# EAGLE design Battery_Monitoring_with_kill (EAGLE 8.4.3)
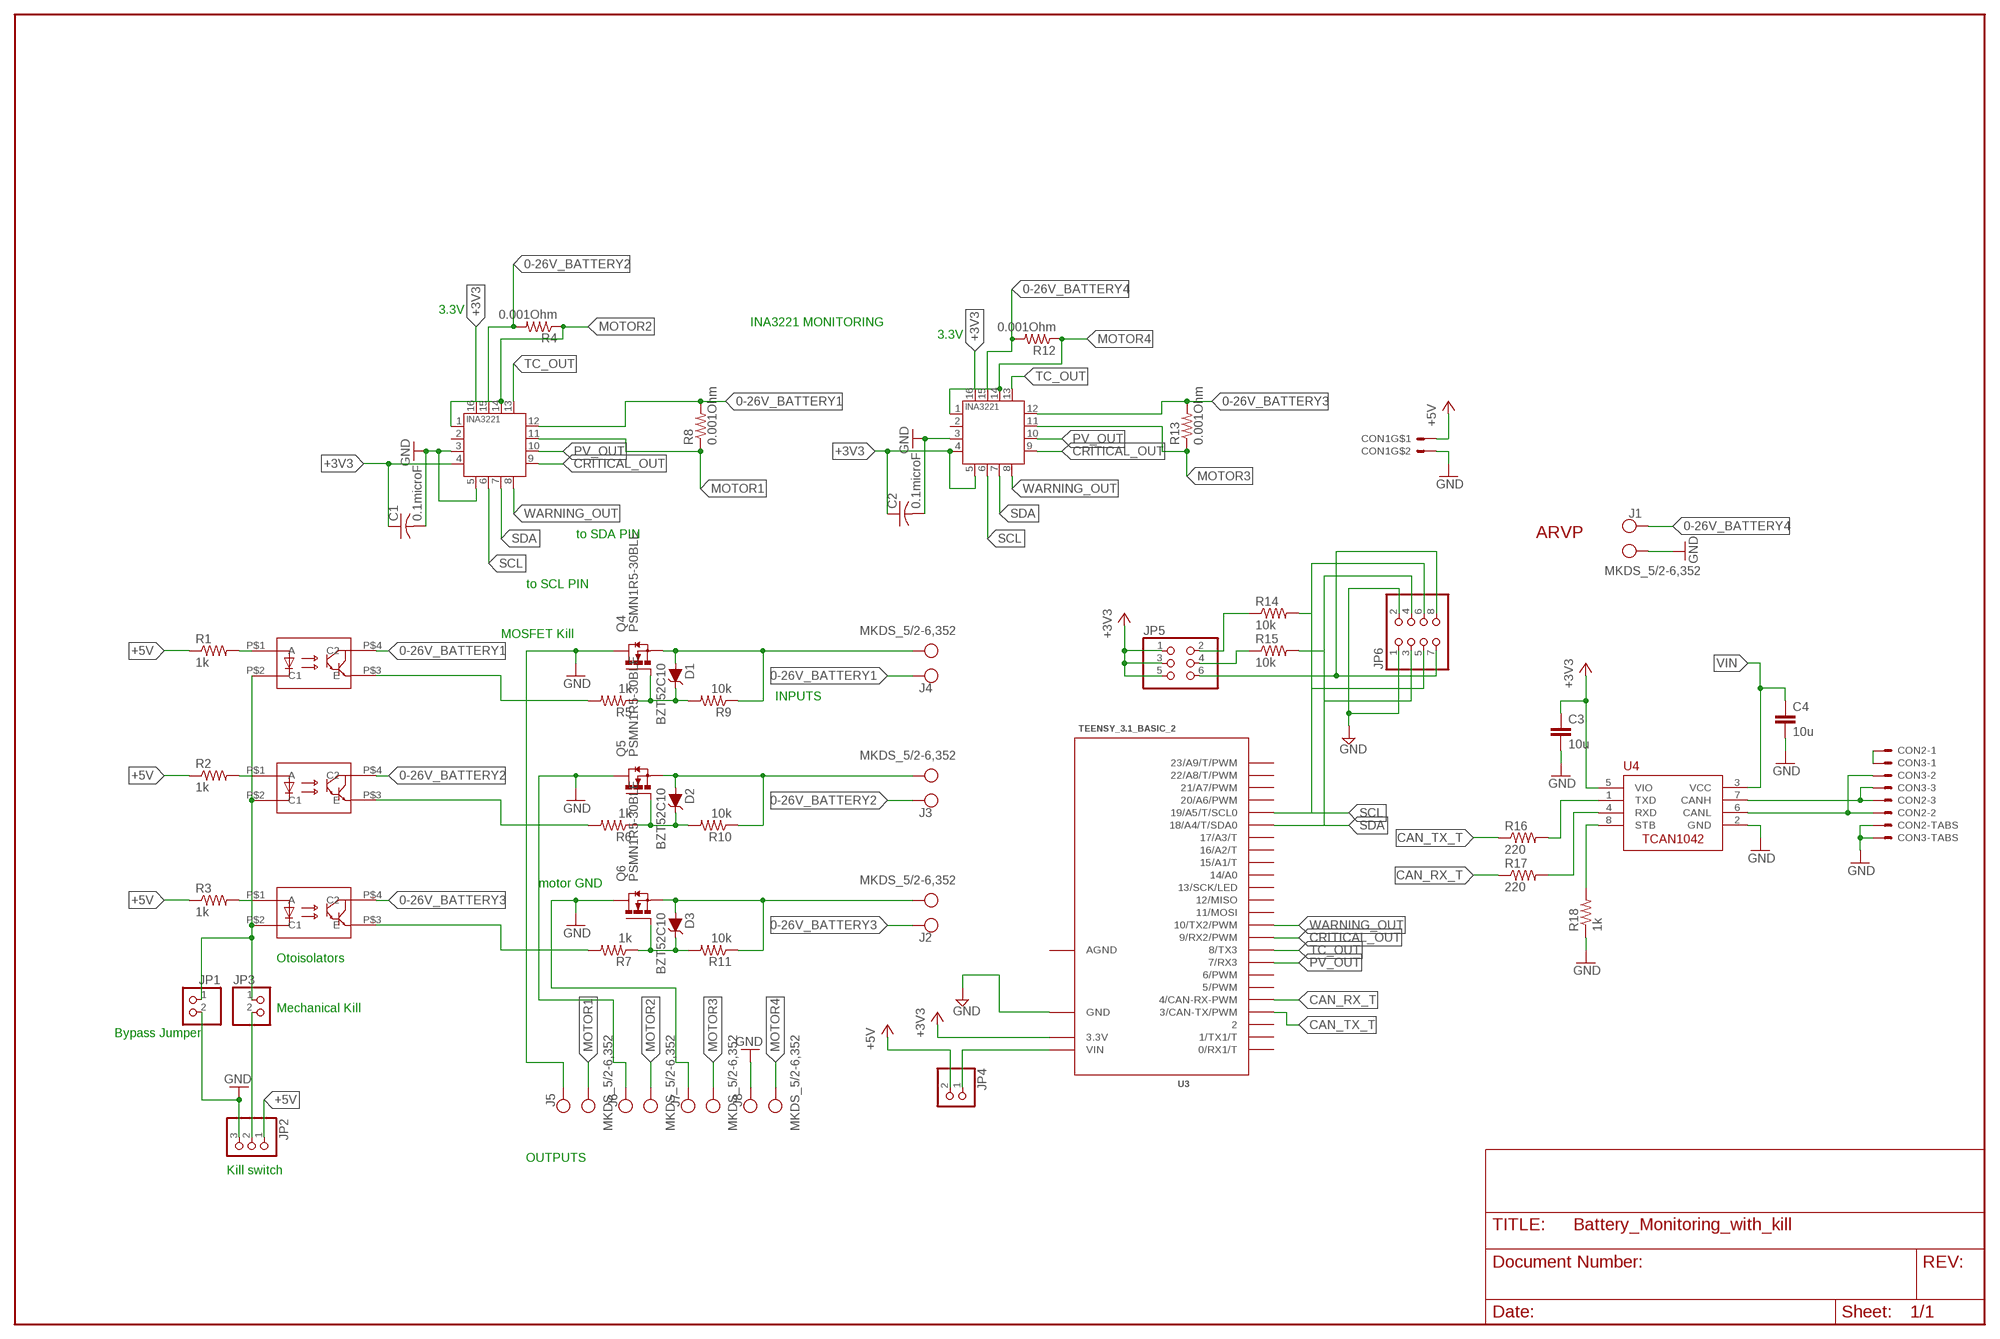
[diagram p0: schematic, sheet 1]

## Parts
ARVP1  ARVP_LOGO  [ARVP]
C1  0.1microF  C-USC2012  [C2012]
C2  0.1microF  C-USC2012  [C2012]
C3  10u  C-EUC0805  [C0805]
C4  10u  C-EUC0805  [C0805]
CON1  MOLEX_5566-2  [5566-2]
CON2  SM03B-GHS-TB  [SM03B-GHS-TB]
CON3  SM03B-GHS-TB  [SM03B-GHS-TB]
D1  BZT52C10  [SOD-123]
D2  BZT52C10  [SOD-123]
D3  BZT52C10  [SOD-123]
J1  MKDS_5/2-6,352  [MKDS_5/2-6,35]
J2  MKDS_5/2-6,352  [MKDS_5/2-6,35]
J3  MKDS_5/2-6,352  [MKDS_5/2-6,35]
J4  MKDS_5/2-6,352  [MKDS_5/2-6,35]
J5  MKDS_5/2-6,352  [MKDS_5/2-6,35]
J6  MKDS_5/2-6,352  [MKDS_5/2-6,35]
J7  MKDS_5/2-6,352  [MKDS_5/2-6,35]
J8  MKDS_5/2-6,352  [MKDS_5/2-6,35]
JP1  PINHD-1X2  [1X02]
JP2  PINHD-1X3  [1X03]
JP3  PINHD-1X2  [1X02]
JP4  PINHD-1X2  [1X02]
JP5  PINHD-2X3  [2X03]
JP6  PINHD-2X4  [2X04]
Q1  TCLD1000CT  [SOP-4L]
Q2  TCLD1000CT  [SOP-4L]
Q3  TCLD1000CT  [SOP-4L]
Q4  PSMN1R5-30BLE  [SOT404/D2PAK]
Q5  PSMN1R5-30BLE  [SOT404/D2PAK]
Q6  PSMN1R5-30BLE  [SOT404/D2PAK]
R1  1k  R-US_R0805  [R0805]
R2  1k  R-US_R0805  [R0805]
R3  1k  R-US_R0805  [R0805]
R4  0.001Ohm  HCS3920FT1L00  [3920]
R5  1k  R-US_M1206  [M1206]
R6  1k  R-US_M1206  [M1206]
R7  1k  R-US_M1206  [M1206]
R8  0.001Ohm  HCS3920FT1L00  [3920]
R9  10k  R-US_M1206  [M1206]
R10  10k  R-US_M1206  [M1206]
R11  10k  R-US_M1206  [M1206]
R12  0.001Ohm  HCS3920FT1L00  [3920]
R13  0.001Ohm  HCS3920FT1L00  [3920]
R14  10k  R-US_R1206  [R1206]
R15  10k  R-US_R1206  [R1206]
R16  220  R-US_R0805  [R0805]
R17  220  R-US_R0805  [R0805]
R18  1k  R-US_R0805  [R0805]
U1  INA3221.  [HVQFN16_4X4]
U2  INA3221.  [HVQFN16_4X4]
U3  TEENSY_3.1_BASIC_2  [TEENSY_3.1_BASIC_2]
U4  TCAN1042HVDR  [SO-8]

## Nets
0-26V_BATTERY1: J4.2(KL1) Q1.P$4(C2) R8.P$2 U1.12(IN+1)
0-26V_BATTERY2: J3.2(KL1) Q2.P$4(C2) R4.P$2 U1.15(IN+2)
0-26V_BATTERY3: J2.2(KL1) Q3.P$4(C2) R13.P$2 U2.12(IN+1)
0-26V_BATTERY4: J1.2(KL1) R12.P$2 U2.15(IN+2)
+3V3: C1.1 C2.1 C3.1 JP5.1 JP5.3 JP5.5 U1.4(VS) U1.16(VPU) U2.4(VS) U2.5(A0) U2.16(VPU) U3.3.3V U4.5(VIO)
+5V: CON1.1 JP2.1 JP4.2 R1.1 R2.1 R3.1
BATT1GND: D1.P$2(A) J4.1(KL) Q4.3S(S) R9.1
BATT2GND: D2.P$2(A) J3.1(KL) Q5.3S(S) R10.1
BATT3GND: D3.P$2(A) J2.1(KL) Q6.3S(S) R11.1
CAN_RX1: R17.2 U4.4(RXD)
CAN_RX_T: R17.1 U3.4(4/CAN-RX-PWM)
CAN_TX2: R16.2 U4.1(TXD)
CAN_TX_T: R16.1 U3.3(3/CAN-TX/PWM)
CANH1: CON2.P$3 CON3.P$3 U4.7(CANH)
CANL1: CON2.P$2 CON3.P$2 U4.6(CANL)
CANSH1: CON2.P$1 CON3.P$1
CRITICAL_OUT: U1.9(CRITICAL) U2.9(CRITICAL) U3.9(9/RX2/PWM)
E1: Q1.P$3(E) R5.2
E2: Q2.P$3(E) R6.2
E3: Q3.P$3(E) R7.2
GND: C1.2 C2.2 C3.2 C4.2 CON1.2 CON2.P$4 CON2.P$5 CON3.P$4 CON3.P$5 J1.1(KL) J5.2(KL1) J6.2(KL1) J7.2(KL1) J8.2(KL1) JP1.2 JP2.3 JP6.1 JP6.2 Q4.2D(D) Q5.2D(D) Q6.2D(D) R18.1 U1.3(GND) U1.5(A0) U2.3(GND) U3.GND U4.2(GND)
I2C_3V1: JP5.6 JP6.7 JP6.8
MG1: D1.P$1(C) Q4.1G(G) R5.1 R9.2
MG2: D2.P$1(C) Q5.1G(G) R6.1 R10.2
MG3: D3.P$1(C) Q6.1G(G) R7.1 R11.2
MOTOR1: J5.1(KL) R8.P$1 U1.11(IN-1)
MOTOR2: J6.1(KL) R4.P$1 U1.1(IN-3) U1.14(IN-2)
MOTOR3: J7.1(KL) R13.P$1 U2.11(IN-1)
MOTOR4: J8.1(KL) R12.P$1 U2.1(IN-3) U2.14(IN-2)
N$1: Q1.P$1(A) R1.2
N$2: Q2.P$1(A) R2.2
N$3: Q3.P$1(A) R3.2
N$4: JP1.1 JP3.1 Q1.P$2(C1) Q2.P$2(C1) Q3.P$2(C1)
N$5: JP2.2 JP3.2
PV_OUT: U1.10(PV) U2.10(PV) U3.7(7/RX3)
SCL: JP6.5 JP6.6 R14.2 U1.6(SCL) U2.6(SCL) U3.19/A5(19/A5/T/SCL0)
SCL_3V1: JP5.2 R14.1
SDA: JP6.3 JP6.4 R15.2 U1.7(SDA) U2.7(SDA) U3.18/A4(18/A4/T/SDA0)
SDA_3V1: JP5.4 R15.1
STB1: R18.2 U4.8(STB)
TC_OUT: U1.13(TC) U2.13(TC) U3.8(8/TX3)
VIN: C4.1 JP4.1 U3.VIN U4.3(VCC)
WARNING_OUT: U1.8(WARNING) U2.8(WARNING) U3.10(10/TX2/PWM)
Unconnected: U1.2(IN+3) U2.2(IN+3) U3.0(0/RX1/T) U3.1(1/TX1/T) U3.2 U3.5(5/PWM) U3.6(6/PWM) U3.11(11/MOSI) U3.12(12/MISO) U3.13(13/SCK/LED) U3.14/A0 U3.15/A1(15/A1/T) U3.16/A2(16/A2/T) U3.17/A3(17/A3/T) U3.20/A6(20/A6/PWM) U3.21/A7(21/A7/PWM) U3.22/A8(22/A8/T/PWM) U3.23/A9(23/A9/T/PWM)

## Notes on the sheet
- 3.3V
- INA3221 MONITORING
- 3.3V
- to SDA PIN
- to SCL PIN
- MOSFET Kill
- INPUTS
- motor GND
- Otoisolators
- Mechanical Kill
- Bypass Jumper
- OUTPUTS
- Kill switch

## Power pins joined to a net without a drawn wire
AGND: U3.AGND

## Library data of the parts
ARVP1 = ARVP:ARVP_LOGO
C1 C2 = resistor:C-US: CAPACITOR, American symbol
C3 C4 = rcl:C-EU: CAPACITOR, European symbol
CON1 = ARVP:MOLEX_5566-2
CON2 CON3 = ARVP:SM03B-GHS-TB
D1-D3 = Moira:BZT52C10: DIODE ZENER 10V 500MW SOD123 by Diodes Incorporated Digikey: BZT52C10-FDICT-ND
J1-J8 = Moira:MKDS_5/2-6,35: CONN TERM BLOCK 2POS 6.35MM PCB, 2 Position Wire to Board Terminal Block Horizontal with Board 0.250" (6.35mm) Through Hole, Phoenix Contact (1714955), Digikey:277-1269-ND, MKDS 5/2-6,35 package adpated from Eagle library package MKDS 5/3-6,35
JP1 JP3 JP4 = pinhead:PINHD-1X2: PIN HEADER
JP2 = pinhead:PINHD-1X3: PIN HEADER
JP5 = pinhead:PINHD-2X3: PIN HEADER
JP6 = pinhead:PINHD-2X4: PIN HEADER
Q1 = Moira:TCLD1000CT: OPTOISOLTR 5KV DARLINGTON 4-SOP by VISHAY Digikey: TCLD1000CT_ND; SPICEPREFIX: E
Q2 Q3 = Moira:TCLD1000CT: OPTOISOLTR 5KV DARLINGTON 4-SOP by VISHAY Digikey: TCLD1000CT_ND
Q4-Q6 = Moira:PSMN1R5-30BLE: N-channel 30 V 1.5 mΩ logic level MOSFET in D2PAK by Nexperia USA Inc. Digikey: 1727-1101-1-ND
R1-R3 R5-R7 R9-R11 = adafruit:R-US_: RESISTOR, American symbol
R4 R8 R12 R13 = Moira:HCS3920: 0.001 Ohm ±1% 5W Chip Resistor 4020 Automotive AEC-Q200, Current Sense, Moisture Resistant Metal Element Stackpole Electronics Inc. Digikey: HCS3920FT1L00CT-ND
R14-R18 = rcl:R-US_: RESISTOR, American symbol
U1 U2 = INA3221:INA3221: The INA3221 is a three-channel, high-side current and bus voltage monitor with an I 2C- and SMBUScompatible interface. The INA3221 monitors both shunt voltage drops and bus supply voltages, in addition to having programmable conversion times and averaging modes for these signals. The INA3221 offers both critical and warning alerts to detect multiple programmable out-of-range conditions for each channel.
U3 = Teensy_3_Series_Board_v1.0:TEENSY_3.1_BASIC_2: Footprint for Teensy 3.1 board using all pin connections on the outer perimeter
U4 = ARVP:TCAN1042HVDR

## Net classes
1 net1: clearance 0.203 mm to class 0

## Board
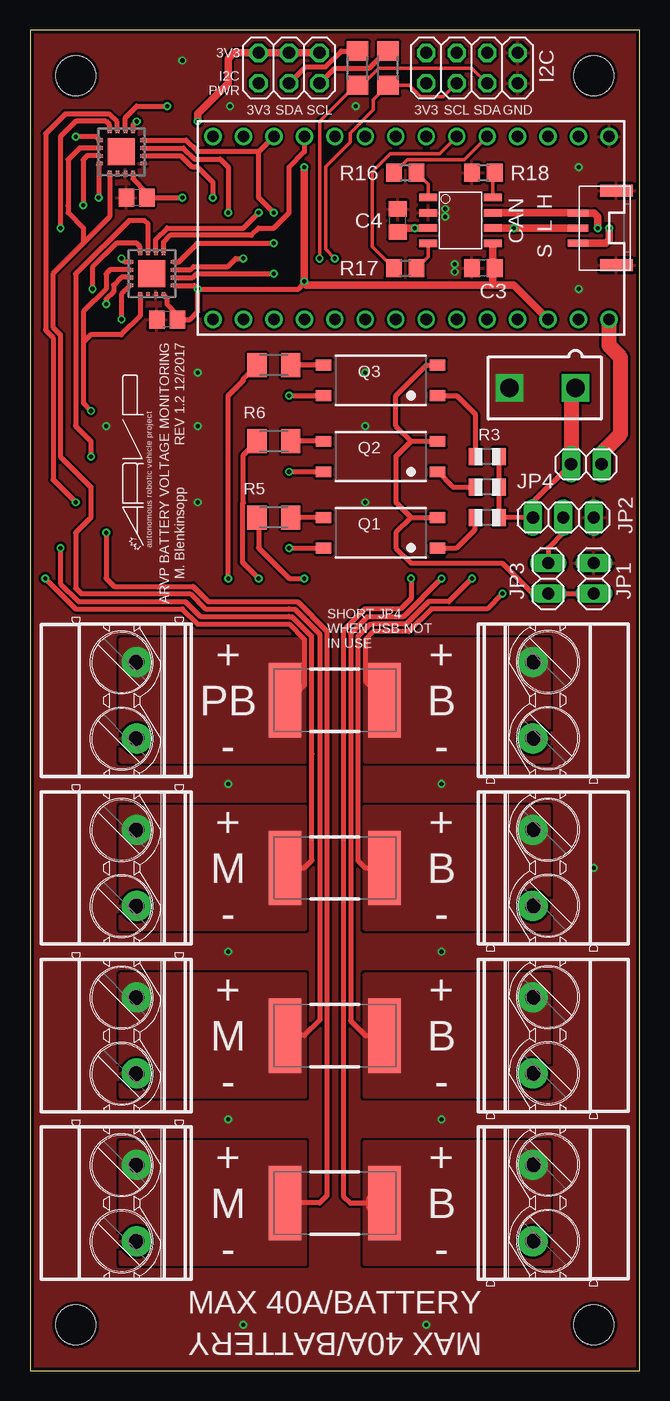
[diagram p1: board, top side]
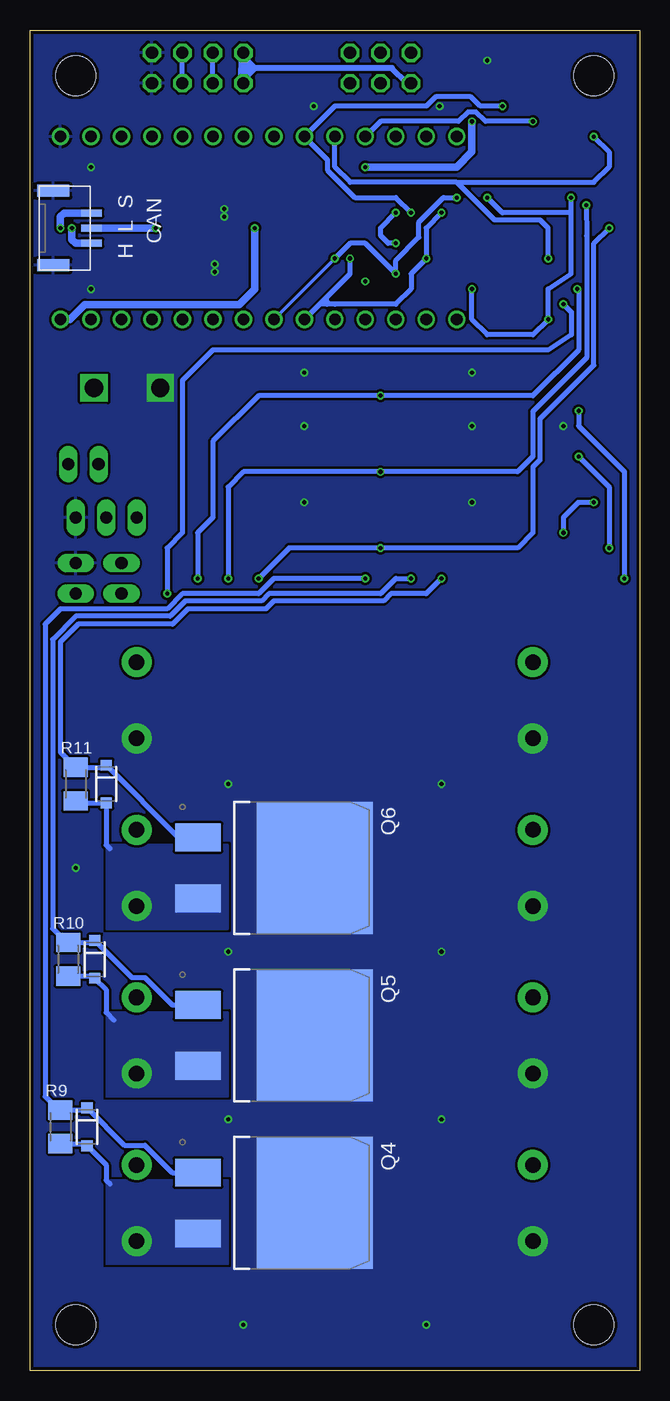
[diagram p2: board, bottom side, seen from below]

Size 50.8 x 111.76 mm. Coordinates in mm from the lower left corner, seen from the top.
Outline: 50.8,0 50.8,111.76 0,111.76 0,0 50.8,0
Copper layers (1*16): Top 0.035mm / dielectric 1.5mm / Bottom 0.035mm
Design rules "ITEADstudioDRC *": minimum track width 6mil, minimum drill 12mil, track to track 8mil, track to pad 8mil, pad to pad 8mil, via to via 8mil, smd to smd 0mil, copper to edge 10mil, drill to drill 10mil, minimum pad ring 6mil, minimum via ring 6mil, stop-mask expansion 2mil, vias tented up to drill 100mil, thermal gap 10mil
Milling: 4 lines

### Footprints (pad centres in the part's own frame; a part is rotated, then mirrored left to right if it is on the bottom)
C2012 = smd 1.3 x 1.5: 1 -0.85,0; 2 0.85,0
C0805 = smd 1.3 x 1.5: 1 -0.95,0; 2 0.95,0
5566-2 = drill 1.524 square: 1 0,-2.756; 2 0,2.756
SM03B-GHS-TB = smd 0.6 x 1.7: P$1 -1.25,0.85; P$2 0,0.85; P$3 1.25,0.85 | smd 1 x 2.7: P$4 -3.1,-2.35; P$5 3.1,-2.35
SOD-123 = smd 0.9 x 0.95: P$1 -1.575,0; P$2 1.575,0
MKDS_5/2-6,35 = drill 1.3 pad 2.5: 1 -3.175,0; 2 3.175,0
1X02 = drill 1.016 long: 1 -1.27,0; 2 1.27,0
1X03 = drill 1.016 long: 1 -2.54,0; 2 0,0; 3 2.54,0
2X03 = drill 1.016 octagon: 1 -2.54,-1.27; 2 -2.54,1.27; 3 0,-1.27; 4 0,1.27; 5 2.54,-1.27; 6 2.54,1.27
2X04 = drill 1.016 octagon: 1 -3.81,-1.27; 2 -3.81,1.27; 3 -1.27,-1.27; 4 -1.27,1.27; 5 1.27,-1.27; 6 1.27,1.27; 7 3.81,-1.27; 8 3.81,1.27
SOP-4L = smd 1.3 x 0.9: P$1 -4.75,1.27; P$2 -4.75,-1.27; P$3 4.75,-1.27; P$4 4.75,1.27
SOT404/D2PAK = smd 2.32 x 3.81: 1G -2.54,-6.32; 3S 2.54,-6.32 | smd 11 x 9.65: 2D 0,3.4
R0805 = smd 1.1 x 1.4: 1 -1,0; 2 1,0
3920 = smd 2.7 x 6.2: P$1 -4.15,0; P$2 4.15,0
M1206 = smd 1.6 x 2: 1 -1.4,0; 2 1.4,0
R1206 = smd 1.6 x 1.803: 1 -1.422,0; 2 1.422,0
R0805' = smd 1.3 x 1.5: 1 -0.95,0; 2 0.95,0
HVQFN16_4X4 = smd 0.5 x 0.3: 1 -1.8,0.975; 2 -1.8,0.325; 3 -1.8,-0.325; 4 -1.8,-0.975; 9 1.8,-0.975; 10 1.8,-0.325; 11 1.8,0.325; 12 1.8,0.975 | smd 0.3 x 0.5: 5 -0.975,-1.8; 6 -0.325,-1.8; 7 0.325,-1.8; 8 0.975,-1.8; 13 0.975,1.8; 14 0.325,1.8; 15 -0.325,1.8; 16 -0.975,1.8 | smd 2.25 x 2.25: TH 0,0
TEENSY_3.1_BASIC_2 = drill 0.965: 0 -7.62,13.97; 1 -7.62,11.43; 2 -7.62,8.89; 3 -7.62,6.35; 3.3V 7.62,11.43; 4 -7.62,3.81; 5 -7.62,1.27; 6 -7.62,-1.27; 7 -7.62,-3.81; 8 -7.62,-6.35; 9 -7.62,-8.89; 10 -7.62,-11.43; 11 -7.62,-13.97; 12 -7.62,-16.51; 13 7.62,-16.51; 14/A0 7.62,-13.97; 15/A1 7.62,-11.43; 16/A2 7.62,-8.89; 17/A3 7.62,-6.35; 18/A4 7.62,-3.81; 19/A5 7.62,-1.27; 20/A6 7.62,1.27; 21/A7 7.62,3.81; 22/A8 7.62,6.35; 23/A9 7.62,8.89; AGND 7.62,13.97; GND -7.62,16.51; VIN 7.62,16.51
SO-8 = smd 1.524 x 0.61: 1 -2.692,1.905; 2 -2.692,0.635; 3 -2.692,-0.635; 4 -2.692,-1.905; 5 2.692,-1.905; 6 2.692,-0.635; 7 2.692,0.635; 8 2.692,1.905
STAND-OFF = hole 3.302: 0,0

### Placement (x,y rotation side)
ARVP1  10.16,68.58 90 top
C1  8.89,97.79 180 top
C2  11.43,87.63 180 top
C3  37.78,91.92 180 top
C4  30.64,95.88 90 top
CON1  42.7,81.91 90 top
CON2  46.51,95.25 90 top
CON3  46.51,95.25 270 bottom
D1  46.04,20.32 270 bottom
D2  45.4,34.29 270 bottom
D3  44.45,48.89 270 bottom
J1  41.91,55.88 90 top
J2  41.91,41.91 90 top
J3  41.91,27.94 90 top
J4  41.91,13.97 90 top
J5  8.89,13.97 270 top
J6  8.89,27.94 270 top
J7  8.89,41.91 270 top
J8  8.89,55.88 270 top
JP1  46.99,66.04 90 top
JP2  44.45,71.12 0 top
JP3  43.18,66.04 90 top
JP4  46.36,75.56 180 top
JP5  21.59,108.59 180 top
JP6  36.83,108.59 180 top
Q1  29.21,69.85 180 top
Q2  29.21,76.2 180 top
Q3  29.21,82.55 180 top
Q4  30.48,13.97 270 bottom
Q5  30.48,27.94 270 bottom
Q6  30.48,41.91 270 bottom
R1  38.1,71.12 180 top
R2  38.1,73.66 180 top
R3  38.1,76.2 180 top
R4  25.4,27.94 0 top
R5  20.32,71.12 0 top
R6  20.32,77.47 0 top
R7  20.32,83.82 0 top
R8  25.4,13.97 0 top
R9  48.26,20.32 90 bottom
R10  47.62,34.29 90 bottom
R11  46.99,48.89 90 bottom
R12  25.4,55.88 0 top
R13  25.4,41.91 0 top
R14  29.84,108.59 270 top
R15  27.31,108.59 270 top
R16  220  [R0805']  31.27,99.85 0 top
R17  220  [R0805']  31.27,91.92 0 top
R18  1k  [R0805']  37.78,99.85 0 top
U1  7.62,101.6 90 top
U2  10.16,91.44 90 top
U3  31.75,95.25 270 top
U4  35.88,95.88 0 top
U$9  [LETTER_P]  -63.5,-71.12 0 top  (outside the outline)
U$15  [DOCFIELD]  20.32,-71.12 0 top  (outside the outline)
U$18  [STAND-OFF]  46.99,107.95 90 top
U$24  [STAND-OFF]  46.99,3.81 90 top
U$25  [STAND-OFF]  3.81,3.81 90 top
U$26  [STAND-OFF]  3.81,107.95 90 top

### Tracks (layer width: path | path; a pad name or v marks a point on that pad's centre or on a via)
0-26V_BATTERY1  (via drill 0.35)
  Top 0.406: U1.12 6.64,103.84 6.35,104.14 3.81,104.14 2.54,102.87 v2.54,95.25 | v21.59,68.58 Q1.P$4 | 29.21,13.97 26.67,13.97 26.11,14.53 26.11,61.72 27.84,63.45 27.89,63.45 27.94,63.5 30.89,63.5 31.75,64.36 v31.75,66.04
  Top 2.54: 29.21,13.97 R8.P$2
  Bottom 0.406: v2.54,95.25 3.81,93.98 3.81,83.82 8.28,79.35 8.28,75.95 8.89,75.34 8.89,69.85 10.16,68.58 v21.59,68.58 29.21,68.58 v31.75,66.04
  pour Top (no thermals): 27.94,8.89 27.94,19.05 43.18,19.05 43.18,8.89
0-26V_BATTERY2  (via drill 0.35)
  Top 0.406: U1.15 4.75,101.28 4.42,100.94 4.42,97.18 v4.44,97.16 | v21.59,74.93 Q2.P$4 | R4.P$2 27.94,27.94 26.72,29.16 26.72,61.47 28.09,62.84 31.09,62.84 v34.29,66.04
  Bottom 0.406: v4.44,97.16 4.42,94.59 4.42,84.43 8.89,79.96 8.89,76.2 10.16,74.93 v21.59,74.93 33.02,74.93 34.29,73.66 v34.29,66.04
  pour Top (no thermals): 27.94,22.86 27.94,33.02 43.18,33.02 43.18,22.86
0-26V_BATTERY3  (via drill 0.35)
  Top 0.406: U2.12 9.19,93.69 8.89,93.98 7.21,93.98 5.2,91.97 v5.2,90.17 | v21.59,81.28 Q3.P$4 | v36.83,66.04 34.9,64.11 33.22,64.11 31.34,62.23 28.58,62.23 28.55,62.2 28.32,62.2 27.33,61.21 27.33,42.52 27.94,41.91 R13.P$2
  Bottom 0.406: v5.2,90.17 5.08,90.05 5.08,85.09 8.89,81.28 v21.59,81.28 31.75,81.28 35.56,77.47 35.56,71.12 36.83,69.85 v36.83,66.04
  pour Top (no thermals): 27.94,36.83 27.94,46.99 43.18,46.99 43.18,36.83
0-26V_BATTERY4  (via drill 0.35)
  Top 0.406: U2.15 8.32,91.16 7.62,91.16 6.96,90.5 6.96,89.92 6.35,89.31 v6.35,88.9 | 30.48,56.81 R12.P$2 27.94,57.49 27.94,60.96 28.58,61.59 31.57,61.59 33.47,63.5 38.1,63.5 v39.37,64.77
  Bottom 0.406: v6.35,88.9 5.69,88.24 5.69,86.36 7.62,85.09 35.56,85.09 38.1,82.55 38.1,69.85 39.37,68.58 v39.37,64.77
  pour Top (no thermals): 27.94,50.8 27.94,60.96 43.18,60.96 43.18,50.8
+3V3  (via drill 0.35)
  Top 0.406: U2.4 11.43,89.34 11.43,88.9 12.28,88.05 C2.1 13.33,87.63 13.97,88.26 v13.97,90.17 | U1.4 8.59,99.35 9.74,98.21 C1.1 v12.7,97.79 | U1.16 5.72,100.52 v5.72,97.79 | U2.16 7.62,89.72 v7.62,87.63 | v13.97,90.17 13.67,90.47 U2.5 | v13.97,90.17 22.38,90.17 22.86,90.65
  Top 0.61: v13.97,104.14 13.97,104.78 16.51,107.31 16.51,109.38 16.99,109.85 JP5.5 JP5.3 JP5.1 | 38.57,92.08 U4.5 | 38.57,92.08 C3.1 38.58,91.76 38.58,90.49 | 38.57,91.92 38.57,92.08 | U3.3.3V 40.32,90.49 38.58,90.49 | 38.58,90.49 23.02,90.49 22.86,90.65 v22.86,90.81 v22.86,100.33
  Bottom 0.406: 5.72,96.52 v5.72,97.79 | 5.72,96.52 11.43,96.52 v12.7,97.79 | v13.97,90.17 13.97,87.63 12.7,86.36 8.89,86.36 v7.62,87.63 7.62,90.17 5.72,91.44 5.72,96.52
  Bottom 0.61: v13.97,104.14 13.97,101.6 15.24,100.33 v22.86,100.33
+5V
  Top 0.406: JP4.2 41.91,72.39 JP2.1 R1.1 R2.1 R3.1
  Top 1.27: JP4.2 45.08,81.54 CON1.1
BATT1GND
  Bottom 0.406: R9.1 46.21,18.92 D1.P$2 44.45,17.16 44.45,15.88 44.13,15.56
  pour Bottom (no thermals): 44.45,15.88 44.45,8.89 34.29,8.89 34.29,15.88
BATT2GND
  Bottom 0.406: R10.1 45.58,32.89 D2.P$2 44.45,31.76 44.45,29.84 43.81,29.21
  pour Bottom (no thermals): 44.45,29.84 44.45,22.86 34.29,22.86 34.29,29.84
BATT3GND
  Bottom 0.406: R11.1 46.81,47.32 D3.P$2 44.45,43.81 44.13,43.5
  pour Bottom (no thermals): 44.45,43.81 44.45,36.83 34.29,36.83 34.29,43.81
CAN_RX1
  Top 0.305: U4.4 33.19,92.88 R17.2
CAN_RX_T
  Top 0.305: U3.4 34.16,101.47 30.03,101.47 28.53,99.96 28.53,93.71 R17.1
CAN_TX2
  Top 0.305: U4.1 33.19,98.89 R16.2
CAN_TX_T
  Top 0.305: U3.3 36.19,100.96 31.43,100.96 31.22,100.75 R16.1
CANH1  (via drill 0.35)
  Top 0.61: U4.7 45.64,96.52 CON2.P$3 47.01,96.5 47.31,96.2 v47.31,95.25
  Bottom 0.61: v47.31,95.25 47.31,94.3 46.99,93.98 45.68,93.98 CON3.P$3
CANL1  (via drill 0.35)
  Top 0.61: U4.6 v40.32,95.25 CON3.P$2
  Bottom 0.61: v40.32,95.25 CON3.P$2
CANSH1  (via drill 0.35)
  Top 0.61: CON2.P$1 47.96,94 48.26,94.3 v48.26,95.25
  Bottom 0.61: v48.26,95.25 48.26,96.2 47.96,96.5 CON3.P$1
CRITICAL_OUT  (via drill 0.35)
  Top 0.406: U1.9 8.59,103.84 v8.89,104.14 | U2.9 11.14,94.09 11.68,94.64 18.44,94.64 19.05,95.25 20.32,95.25 21.59,96.52 21.59,100.33 22.86,101.6 U3.9
  Bottom 0.406: v8.89,104.14 12.86,104.14 13.64,104.92 14.3,104.92 15.08,104.14 21.59,104.14 U3.9
E1
  Top 0.406: Q1.P$3 R5.2
E2
  Top 0.406: Q2.P$3 R6.2
E3
  Top 0.406: Q3.P$3 R7.2
GND  (via drill 0.35)
  Top 0.406: 10.48,87.72 C2.2 | 7.94,97.88 C1.2
  other vias: 35.4,92.23 35.4,91.6 34.61,96.84 34.61,96.2 16.67,105.41 27.15,105.41 27.94,83.19 27.94,78.74 27.94,72.39 46.99,41.91 17.78,3.81 33.02,3.81 16.51,20.95 16.51,34.92 16.51,48.89 34.29,48.89 34.29,34.92 34.29,20.95 13.97,72.39 13.97,78.74 13.97,83.19 45.72,90.17 45.72,100.33 12.7,109.22 6.35,78.74
  pour Top (no thermals): 42.07,80.49 42.07,83.34 37.94,83.34 37.94,80.49
  pour Bottom (no thermals): 42.07,80.49 42.07,83.34 37.94,83.34 37.94,80.49
  pour Bottom (rank 2): 50.48,0.32 50.48,111.44 0.32,111.44 0.32,0.32
  pour Top (rank 3): 50.48,0.32 50.48,111.44 0.32,111.44 0.32,0.32
  pour Bottom (no thermals): 6.35,54.61 6.35,50.16 11.43,50.16 11.43,54.61
  pour Bottom (no thermals): 40,54.61 40,50.8 43.81,50.8 43.81,54.61
  pour Bottom (no thermals): 33.02,34.29 33.02,21.59 6.35,21.59 6.35,34.29
  pour Bottom (no thermals): 33.02,48.26 33.02,35.56 6.35,35.56 6.35,48.26
  pour Bottom (no thermals): 33.02,20.32 33.02,7.62 6.35,7.62 6.35,20.32
I2C_3V1
  Bottom 0.508: JP5.6 19.37,107.31 20.64,108.59 33.02,108.59 | 33.02,109.54 32.07,108.59 33.02,107.63
  Bottom 0.813: JP6.7 33.02,109.54 33.02,108.59 33.02,107.63 JP6.8
MG1  (via drill 0.35)
  Top 0.406: 18.79,71.25 R5.1 19.05,70.99 19.05,68.58 21.59,66.04 v22.86,66.04
  Bottom 0.406: v22.86,66.04 30.48,66.04 31.75,64.77 38.1,64.77 39.37,63.5 48.26,63.5 49.53,62.23 49.53,22.86 48.39,21.72 R9.2 46.21,21.72 D1.P$1 42.94,18.8 41.22,18.8 38.93,16.51 Q4.1G
MG2  (via drill 0.35)
  Top 0.406: 18.79,77.6 R6.1 17.78,76.33 17.78,72.35 17.71,72.29 17.71,67.38 v19.05,66.04
  Bottom 0.406: v19.05,66.04 20.32,66.04 21.59,64.77 30.89,64.77 31.5,64.16 37.85,64.16 39.12,62.89 46.99,62.89 48.92,60.96 48.92,36.85 47.75,35.69 R10.2 45.58,35.69 D2.P$1 42.31,32.77 41.22,32.77 38.93,30.48 Q5.1G
MG3  (via drill 0.35)
  Top 0.406: 18.79,83.95 R7.1 17.78,82.68 17.78,82.55 16.51,81.28 v16.51,66.04
  Bottom 0.406: v16.51,66.04 17.78,64.77 20.73,64.77 21.34,64.16 30.48,64.16 31.14,63.5 37.65,63.5 38.92,62.23 46.79,62.23 48.26,60.76 48.26,51.56 R11.2 44.62,50.3 D3.P$1 38.43,44.45 Q6.1G
MOTOR1  (via drill 0.35)
  Top 0.406: U1.11 7.25,103.44 7.25,104.1 6.6,104.75 2.92,104.75 1.3,103.12 1.3,86.74 1.93,86.11 1.93,74.27 v3.81,72.39 | v6.35,69.85 6.35,66.04 7.01,65.38 13.59,65.38 14.86,64.11 22.3,64.11 24.74,61.67 24.74,14.58 24.13,13.97 R8.P$1
  Bottom 0.406: v3.81,72.39 5.08,72.39 6.35,71.12 v6.35,69.85
  pour Top (no thermals): 7.62,8.89 7.62,19.05 22.86,19.05 22.86,8.89
MOTOR2
  Top 0.406: U1.14 4.14,101.92 3.17,100.97 3.17,97.16 3.15,97.13 3.17,97.1 3.17,96.52 4.44,95.25 4.44,93.98 | U1.1 6.64,96.18 4.44,93.98 | 4.44,93.98 1.91,91.44 1.91,87 2.54,86.36 2.54,76.2 5.08,73.66 5.08,71.12 3.81,69.85 3.81,65.22 4.26,64.77 13.33,64.77 14.61,63.5 21.59,63.5 21.61,63.47 22.07,63.47 24.13,61.41 24.13,29.21 22.86,27.94 R4.P$1
  pour Top (no thermals): 7.62,22.86 7.62,33.02 22.86,33.02 22.86,22.86
MOTOR3  (via drill 0.35)
  Top 0.406: U2.11 9.83,95.57 9.53,95.88 8.25,95.88 3.81,91.44 3.81,78.74 5.08,77.47 v5.08,76.2 | v2.54,68.58 2.54,65.63 4.06,64.11 12.95,64.11 14.2,62.87 21.59,62.87 21.61,62.84 21.84,62.84 23.47,61.21 23.47,51.46 23.5,51.44 23.5,42.55 22.86,41.91 R13.P$1
  Bottom 0.406: v5.08,76.2 2.54,73.66 v2.54,68.58
  pour Top (no thermals): 7.62,36.83 7.62,46.99 22.86,46.99 22.86,36.83
MOTOR4  (via drill 0.35)
  Top 0.406: U2.14 6.67,91.76 6.35,91.44 6.35,90.17 4.44,88.26 4.44,85.72 | U2.1 9.19,87.92 7.62,86.36 5.08,86.36 4.44,85.72 | 4.44,85.72 4.44,80.64 v5.08,80.01 | v1.27,66.04 3.81,63.5 12.7,63.5 13.97,62.23 21.59,62.23 22.86,60.96 22.86,57.15 21.59,55.88 R12.P$1
  Bottom 0.406: v5.08,80.01 5.08,78.74 1.27,74.93 v1.27,66.04
  pour Top (no thermals): 7.62,50.8 7.62,60.96 22.86,60.96 22.86,50.8
N$1
  Top 0.406: Q1.P$1 35.56,68.58 37.1,70.12 R1.2
N$2
  Top 0.406: R2.2 35.23,73.66 Q2.P$1
N$3
  Top 0.406: Q3.P$1 35.56,81.28 37.1,79.74 R3.2
N$4
  Top 0.406: JP1.1 JP3.1 41.91,64.77 39.37,67.31 31.75,67.31 30.48,68.58 30.48,69.85 31.75,71.12 | 31.75,77.47 30.48,78.74 30.48,81.28 33.02,83.82 Q3.P$2 | 31.75,77.47 30.48,76.2 30.48,72.39 31.75,71.12 | 31.75,77.47 Q2.P$2 | 31.75,71.12 Q1.P$2
N$5
  Top 0.406: JP2.2 44.45,69.85 43.18,68.58 JP3.2
PV_OUT  (via drill 0.35)
  Top 0.406: U1.10 7.94,104.47 8.89,105.41 v11.43,105.41 | U2.10 10.48,94.31 11.43,95.25 17.78,95.25 v19.05,96.52
  Bottom 0.406: v11.43,105.41 13.27,105.41 14.05,106.19 16.99,106.19 17.78,105.41 25.4,105.41 U3.7 26.01,100.94 26.01,100.08 23.72,97.79 20.32,97.79 v19.05,96.52
SCL  (via drill 0.35)
  Top 0.305: v25.4,92.71 24.64,93.47 24.64,100.36 26.67,102.39 26.67,103.17 28.62,105.13 28.62,105.94 R14.2 31.59,107.16 32.56,106.2 34.44,106.2 JP6.6
  Top 0.406: v20.32,91.44 13.88,91.44 13.56,91.12 U2.6 | U1.6 12.57,101.28 13.47,100.38 13.92,100.38 15.24,99.06 v15.24,97.79
  Bottom 0.305: v25.4,92.71 U3.19/A5
  Bottom 0.406: JP6.6 JP6.5 | v25.4,92.71 24.13,93.98 22.86,93.98 v20.32,91.44 20.32,92.55 18.39,94.48 18.39,95.75 16.35,97.79 v15.24,97.79
SCL_3V1
  Top 0.406: JP5.2 25.4,108.59 28.26,108.59 29.68,110.01 R14.1
SDA  (via drill 0.35)
  Top 0.305: v24.13,92.71 24.13,104.14 27.15,107.16 R15.2 27.63,107.16 29.05,108.59 36.83,108.59 JP6.4
  Top 0.406: U2.7 13.34,91.76 13.63,92.05 16.48,92.05 17.14,92.71 v17.78,92.71 | U1.7 12.78,101.92 13.72,100.99 15.85,100.99 16.51,100.33 v16.51,96.52
  Bottom 0.305: 26.03,89.53 24.13,91.44 | 26.35,89.22 26.03,89.53 | 26.35,89.22 26.67,88.9 | 26.03,89.22 26.03,89.53 | 26.03,89.22 26.03,88.9 26.35,89.22 | 25.4,88.9 25.72,88.9 26.03,89.22
  Bottom 0.406: JP6.4 JP6.3 | 26.67,88.9 26.03,88.9 25.4,88.9 20.32,88.9 19.05,90.17 19.05,91.44 v17.78,92.71 17.78,95.25 v16.51,96.52 | 26.67,88.9 U3.18/A4 | 26.67,88.9 24.13,91.44 v24.13,92.71
SDA_3V1
  Top 0.406: JP5.4 22.96,108.69 24.61,108.69 25.93,110.01 R15.1
STB1
  Top 0.305: R18.2 38.57,99.69 U4.8
TC_OUT  (via drill 0.35)
  Top 0.406: U1.13 5.53,102.87 v3.81,102.87 | U2.13 7.92,92.41 v7.62,92.71
  Bottom 0.406: v3.81,102.87 2.54,101.6 2.54,100.33 3.81,99.06 15.24,99.06 | 15.24,99.06 24.13,99.06 25.4,100.33 U3.8 | v7.62,92.71 7.62,95.25 8.28,95.91 12.09,95.91 15.24,99.06
VIN  (via drill 0.35)
  Top 0.61: C4.1 30.8,95.25 v32.07,95.25 U4.3 33.34,95.25
  Top 1.27: JP4.1 47.62,76.48 49.22,78.08 49.22,84.48 48.26,85.45 U3.VIN
  Bottom 0.61: U3.VIN 47.48,87.63 46.24,88.88 33.36,88.88 32.07,90.17 v32.07,95.25
WARNING_OUT  (via drill 0.35)
  Top 0.406: U1.8 13,102.57 13.97,101.6 19.05,101.6 | U3.10 19.05,101.6 | U2.8 12.41,92.41 13.97,93.98 v20.32,93.98 | v20.32,96.52 19.05,97.79 19.05,101.6
  Bottom 0.406: v20.32,93.98 20.95,93.98 21.59,94.62 21.59,95.25 v20.32,96.52

### Text on the board
tPlace: ARVP BATTERY VOLTAGE MONITORING | REV 1.2 12/2017 | M. Blenkinsopp
tNames: 3V3 | I2C | I2C / PWR | 3V3 | SDA | SCL | 3V3 | SCL | SDA | GND | H | CAN | L | S | SHORT JP4 / WHEN USB NOT / IN USE | + / PB / - | + / B / - | + / M / - | + / B / - | + / M / - | + / B / - | + / M / - | + / B / - | MAX 40A/BATTERY | MAX 40A/BATTERY
bNames: S | CAN | L | H